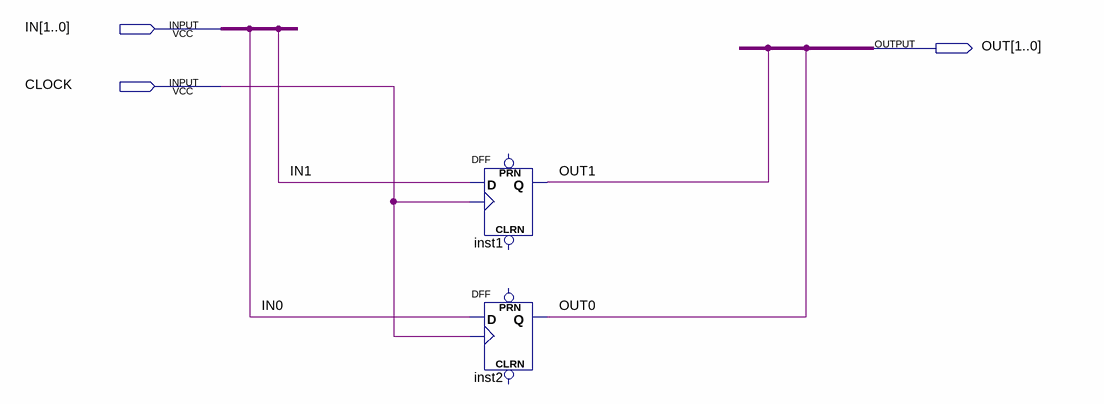
[diagram p0: schematic sheet]
// Quartus schematic Mealy_RegisterBlock.bdf as structural Verilog: 2 symbols, 3 pins
module Mealy_RegisterBlock (
  input  [1:0] IN,
  input  CLOCK,
  output [1:0] OUT
);

  DFF inst1 (.CLK(CLOCK), .D(IN[1]), .Q(OUT[1]));  // open: CLRN, PRN
  DFF inst2 (.CLK(CLOCK), .D(IN[0]), .Q(OUT[0]));  // open: CLRN, PRN
endmodule
